# EAGLE design MJ838 - base (EAGLE 9.6.2)
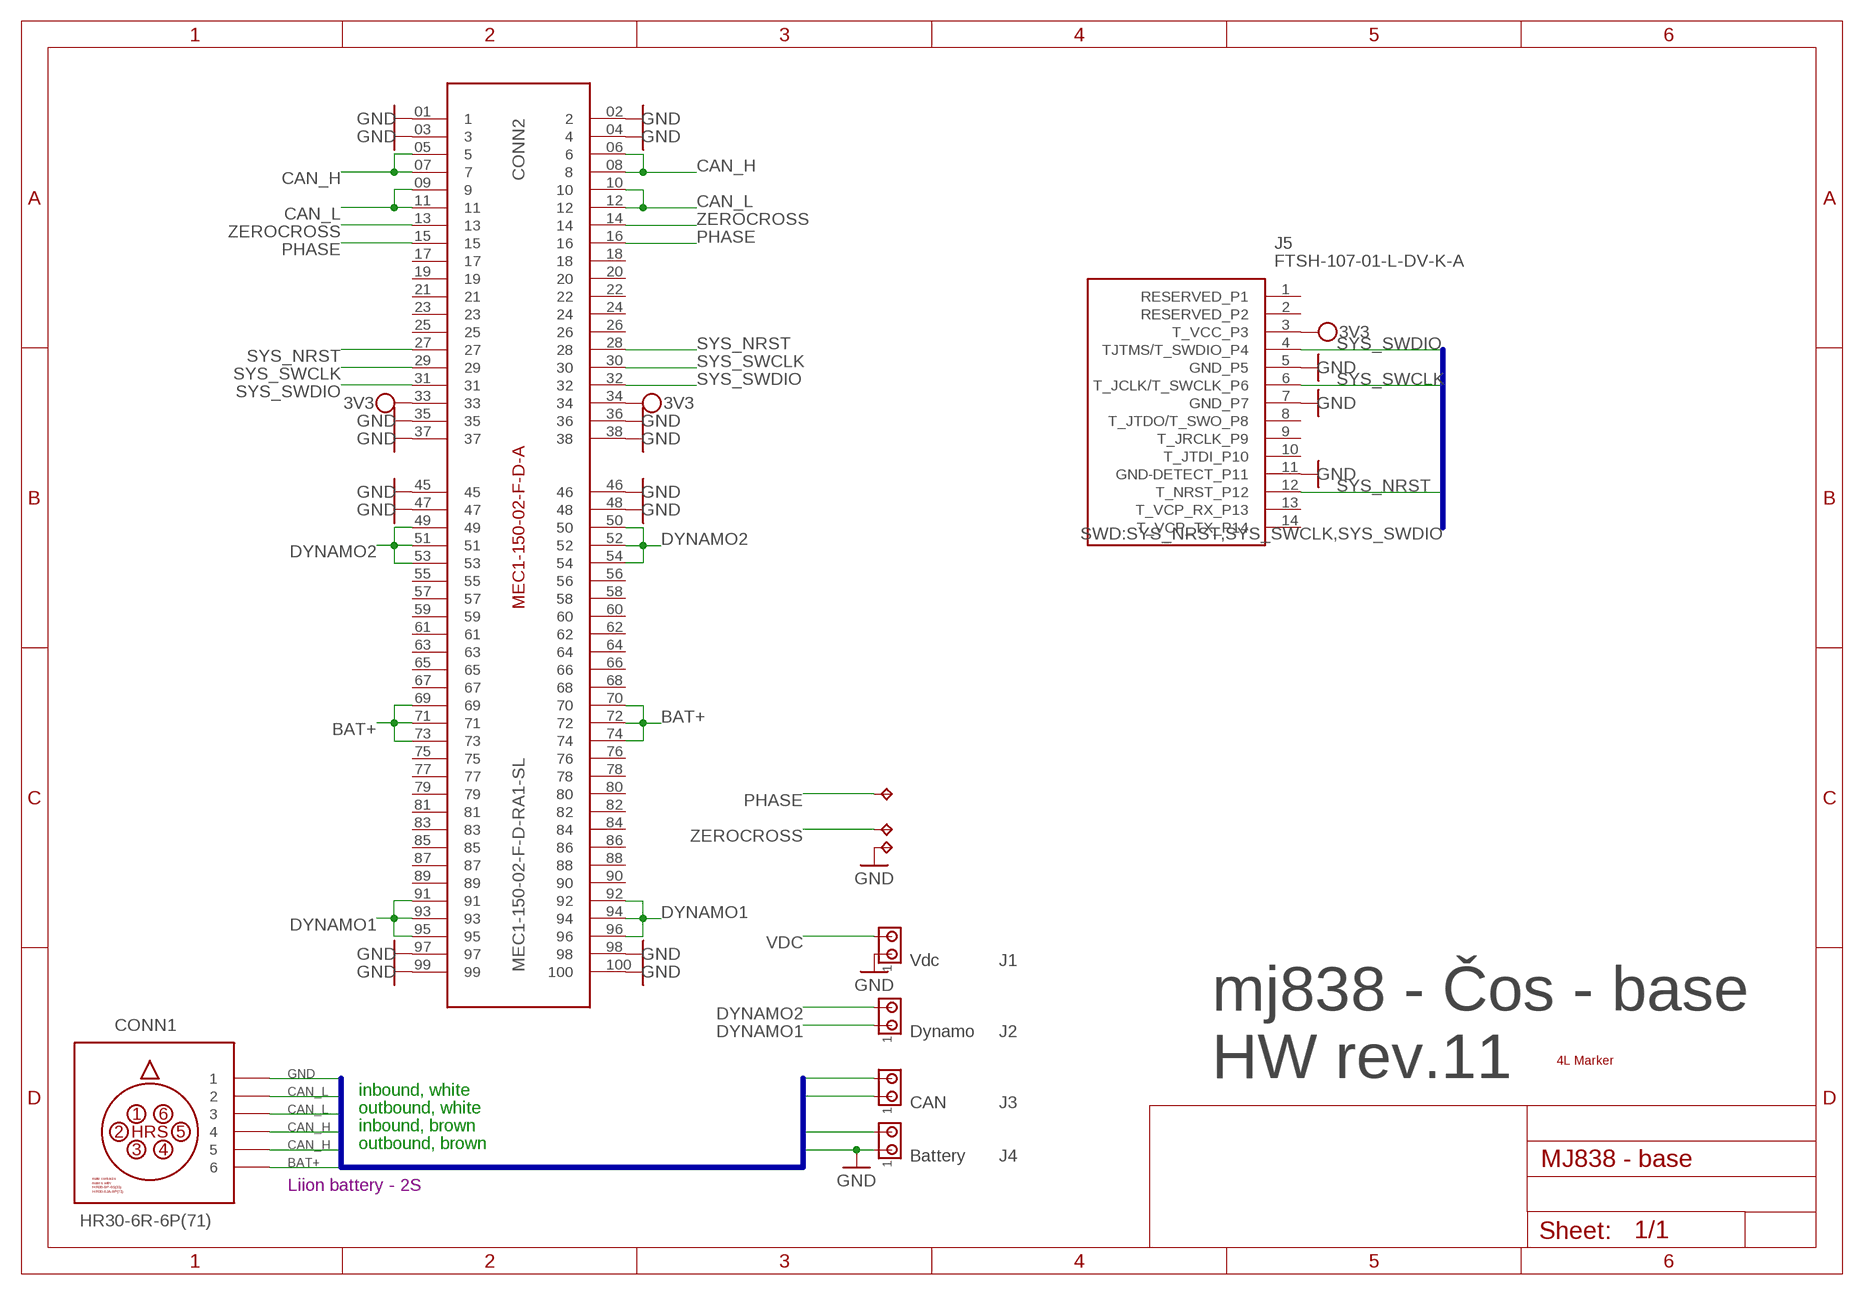
[diagram p0: schematic, sheet 1]

## Parts
CONN1  HR30-6R-6P(71)  HR-30-6R-6X  (no package)
CONN2  MEC1-150-02-F-D-RA1-SL  MEC1-150-2-F-D-RA  [SAMTEC_MEC1-150-2-F-D-RA1]
J1  Vdc  MTA02-100  [10X02MTA]
J2  Dynamo  MTA02-100  [10X02MTA]
J3  CAN  MTA02-100  [10X02MTA]
J4  Battery  MTA02-100  [10X02MTA]
J5  FTSH-107-01-L-DV-K-A  [FTSH10701LDVKA]
MARKER2  4L  [4L]
TP1  TPPAD1-13  [P1-13]
TP2  TPPAD1-13  [P1-13]
TP3  TPPAD1-13  [P1-13]

## Nets
3V3 [3V3]: CONN2.33 CONN2.34 J5.3(T_VCC_P3)
BAT+ [BAT+]: CONN1.6 CONN2.69 CONN2.70 CONN2.71 CONN2.72 CONN2.73 CONN2.74 J4.2
CAN_H [signal]: CONN1.4 CONN1.5 CONN2.05 CONN2.06 CONN2.07 CONN2.08 J3.2
CAN_L [signal]: CONN1.2 CONN1.3 CONN2.09 CONN2.10 CONN2.11 CONN2.12 J3.1
DYNAMO1 [Vac]: CONN2.91 CONN2.92 CONN2.93 CONN2.94 CONN2.95 CONN2.96 J2.1
DYNAMO2 [Vac]: CONN2.49 CONN2.50 CONN2.51 CONN2.52 CONN2.53 CONN2.54 J2.2
GND: CONN1.1 CONN2.01 CONN2.02 CONN2.03 CONN2.04 CONN2.35 CONN2.36 CONN2.37 CONN2.38 CONN2.45 CONN2.46 CONN2.47 CONN2.48 CONN2.97 CONN2.98 CONN2.99 CONN2.100 J1.1 J4.1 J5.5(GND_P5) J5.7(GND_P7) J5.11(GND-DETECT_P11) TP1.TP
PHASE: CONN2.15 CONN2.16 TP3.TP
SYS_NRST: CONN2.27 CONN2.28 J5.12(T_NRST_P12)
SYS_SWCLK [signal]: CONN2.29 CONN2.30 J5.6(T_JCLK/T_SWCLK_P6)
SYS_SWDIO [signal]: CONN2.31 CONN2.32 J5.4(TJTMS/T_SWDIO_P4)
VDC [Vdc]: J1.2
ZEROCROSS [signal]: CONN2.13 CONN2.14 TP2.TP
Unconnected: CONN2.17 CONN2.18 CONN2.19 CONN2.20 CONN2.21 CONN2.22 CONN2.23 CONN2.24 CONN2.25 CONN2.26 CONN2.55 CONN2.56 CONN2.57 CONN2.58 CONN2.59 CONN2.60 CONN2.61 CONN2.62 CONN2.63 CONN2.64 CONN2.65 CONN2.66 CONN2.67 CONN2.68 CONN2.75 CONN2.76 CONN2.77 CONN2.78 CONN2.79 CONN2.80 CONN2.81 CONN2.82 CONN2.83 CONN2.84 CONN2.85 CONN2.86 CONN2.87 CONN2.88 CONN2.89 CONN2.90 J5.1(RESERVED_P1) J5.2(RESERVED_P2) J5.8(T_JTDO/T_SWO_P8) J5.9(T_JRCLK_P9) J5.10(T_JTDI_P10) J5.13(T_VCP_RX_P13) J5.14(T_VCP_TX_P14)

## Buses
MJ8X8-BUS:BAT+,CAN_H,CAN_L,GND
SWD:SYS_NRST,SYS_SWCLK,SYS_SWDIO

## Notes on the sheet
- mj838 - Čos - base
  HW rev.11
- inbound, white
- outbound, white
- inbound, brown
- outbound, brown
- Liion battery - 2S

## Library data of the parts
CONN1 = HR30-6R-6P - PushPull Receptacle:HR-30-6R-6X
CONN2 = Samtec MEC1 - Card Edge Connector:MEC1-150-2-F-D-RA
J1-J4 = con-amp:MTA02-100: AMP connector
J5 = STM32 JTAG 1.27mm 14pin header:FTSH-107-01-L-DV-K-A: Headers & Wire Housings .050" Micro Terminal Strip Source: Datasheet <https://componentsearchengine.com/Datasheets/1/FTSH-107-01-L-DV-K-A.pdf>; DESCRIPTION: Headers & Wire Housings .050" Micro Terminal Strip; HEIGHT: 5.97mm; MANUFACTURER_NAME: SAMTEC; MANUFACTURER_PART_NUMBER: FTSH-107-01-L-DV-K-A; MOUSER_PART_NUMBER: 200-FTSH10701LDVKA; MOUSER_PRICE-STOCK: https://www.mouser.com/Search/Refine.aspx?Keyword=200-FTSH10701LDVKA
MARKER2 = Layer Markers:4L
TP1-TP3 = testpad:TP: Test pad

## Net classes
0 GND: width 0.25 mm, drill 0.35 mm, clearance 0.19 mm
1 BAT+: width 0.5 mm, drill 0.35 mm, clearance 0.5 mm to class 0, clearance 0.5 mm
2 signal: width 0.25 mm, drill 0.35 mm, clearance 0.19 mm to class 0, clearance 0.19 mm to class 1, clearance 0.19 mm
3 3V3: width 0.25 mm, drill 0.35 mm, clearance 0.19 mm to class 0, clearance 0.19 mm to class 1, clearance 0.19 mm to class 2, clearance 0.19 mm
4 Vdc: width 0.5 mm, drill 0.35 mm, clearance 0.5 mm to class 0, clearance 0.5 mm to class 1, clearance 0.5 mm to class 2, clearance 0.5 mm to class 3, clearance 0.5 mm
5 Vdynamo: width 0.5 mm, drill 0.35 mm, clearance 0.5 mm to class 0, clearance 0.5 mm to class 1, clearance 0.5 mm to class 2, clearance 0.5 mm to class 3, clearance 0.5 mm to class 4, clearance 0.5 mm
6 Vac: width 0.5 mm, drill 0.35 mm, clearance 0.5 mm to class 0, clearance 0.5 mm to class 1, clearance 0.5 mm to class 2, clearance 0.5 mm to class 3, clearance 0.5 mm to class 4, clearance 0.5 mm to class 5, clearance 0.5 mm

## Board
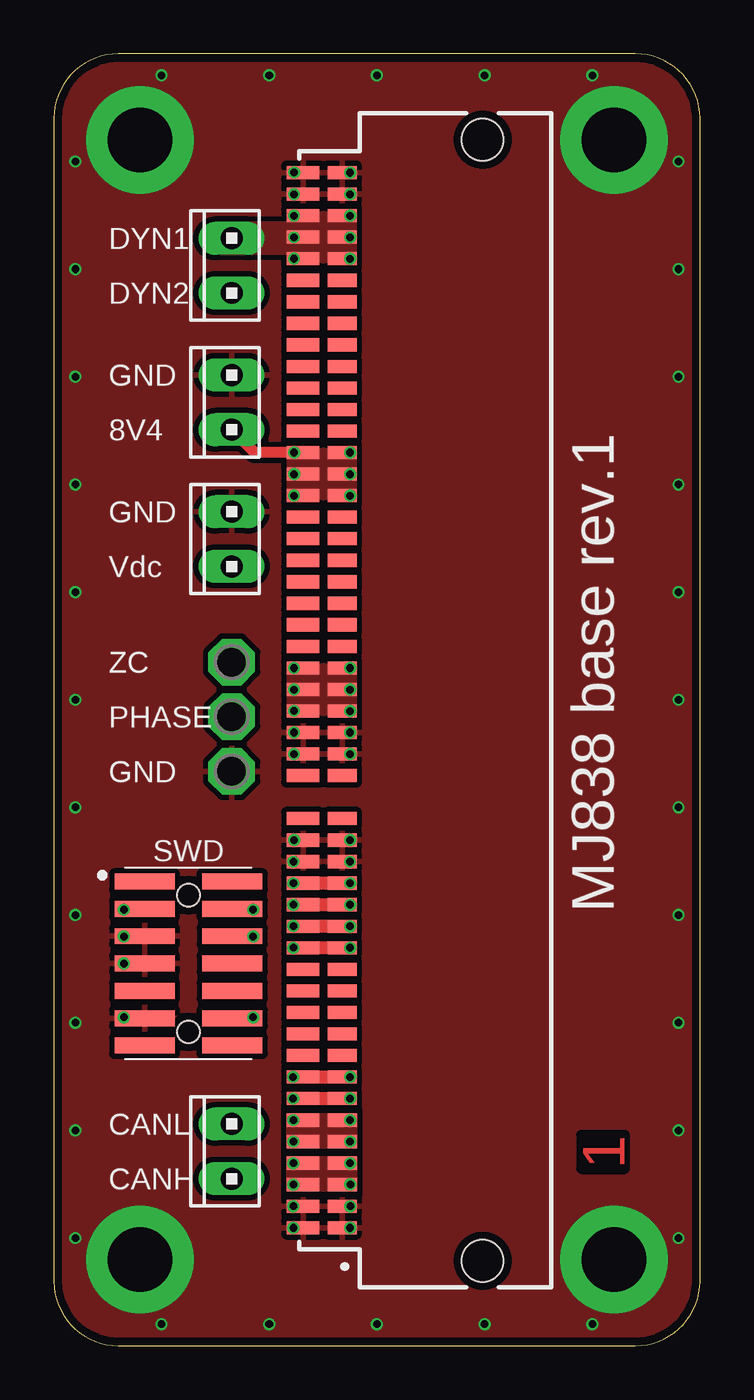
[diagram p1: board, top side]
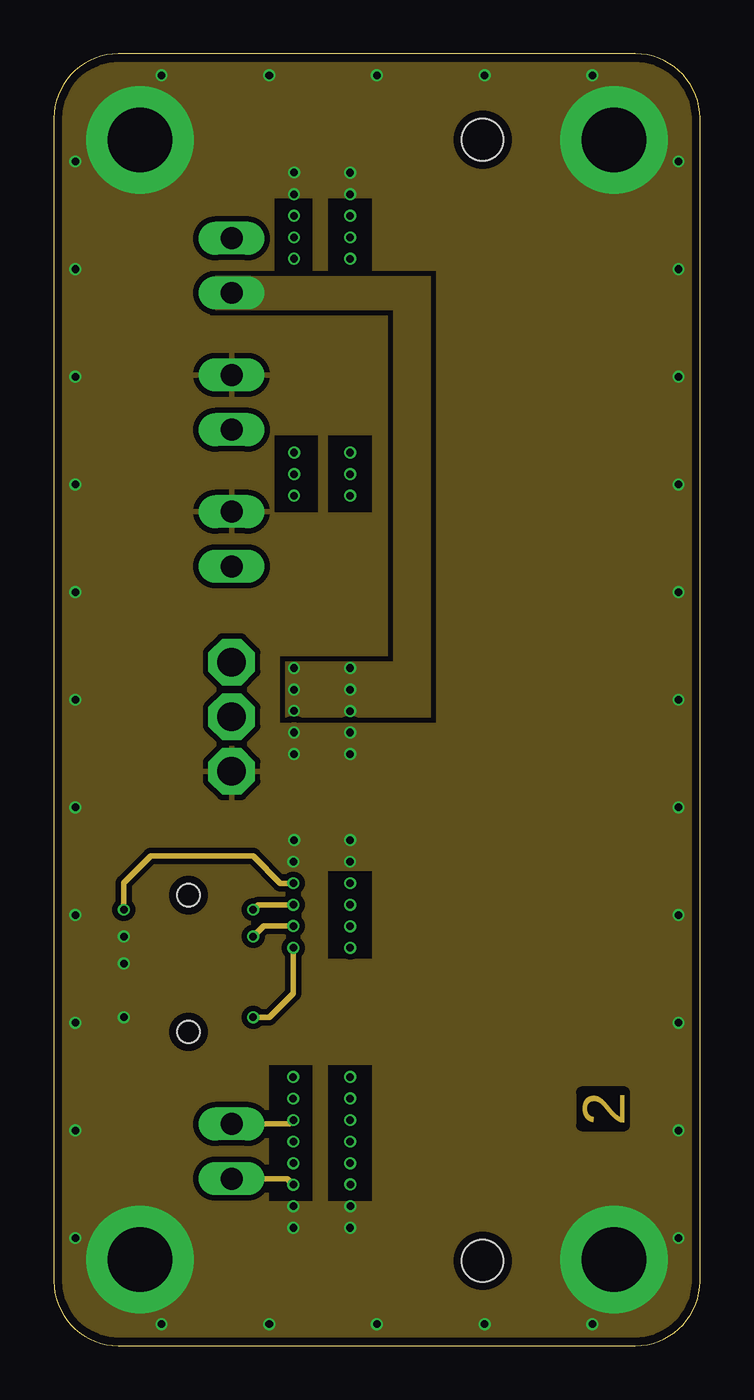
[diagram p2: board, inner layer Route2]
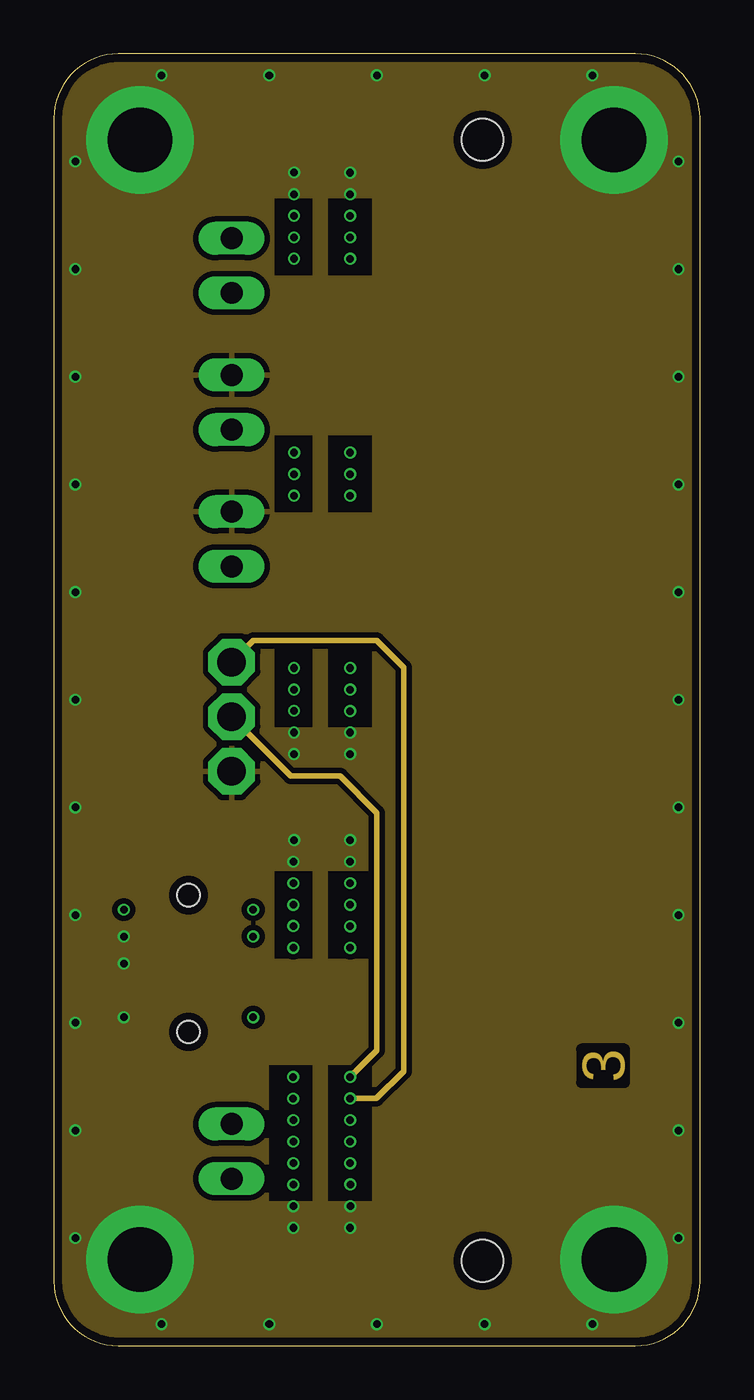
[diagram p3: board, inner layer Route15]
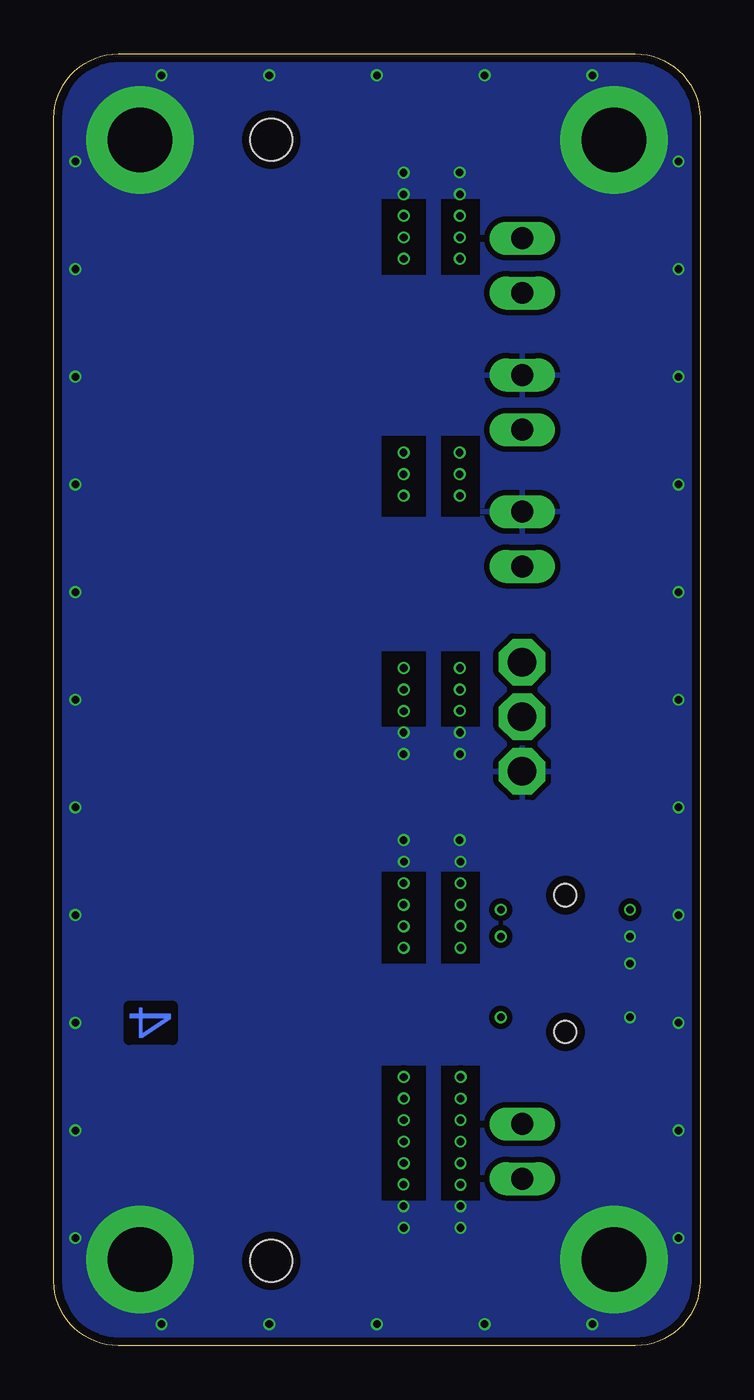
[diagram p4: board, bottom side, seen from below]

Size 30 x 60 mm. Coordinates in mm from the lower left corner, seen from the top.
Outline: 0,57 0,3 arc90 3,0 27,0 arc90 30,3 30,57 arc90 27,60 3,60 arc90 0,57
Copper layers (1*2*15*16): Top 0.035559375mm / dielectric 0.17018125mm / Route2 0.01778125mm / dielectric 47mil / Route15 0.01778125mm / dielectric 0.17018125mm / Bottom 0.035559375mm
Design rules "oshpark-4layer": minimum track width 5mil, minimum drill 10mil, track to track 5mil, track to pad 5mil, pad to pad 5mil, via to via 5mil, smd to smd 5mil, copper to edge 15mil, drill to drill 6mil, minimum pad ring 4mil, minimum via ring 4mil, stop-mask expansion 1.5mil, vias tented up to drill 0mil, thermal gap 10mil

### Footprints (pad centres in the part's own frame; a part is rotated, then mirrored left to right if it is on the bottom)
SAMTEC_MEC1-150-2-F-D-RA1 = smd 0.61 x 1.35: 01 -25.77,5.247; 03 -24.77,5.247; 05 -23.77,5.247; 07 -22.77,5.247; 09 -21.77,5.247; 11 -20.77,5.247; 13 -19.77,5.247; 15 -18.77,5.247; 17 -17.77,5.247; 19 -16.77,5.247; 21 -15.77,5.247; 23 -14.77,5.247; 25 -13.77,5.247; 27 -12.77,5.247; 29 -11.77,5.247; 31 -10.77,5.247; 33 -9.77,5.247; 35 -8.77,5.247; 37 -7.77,5.247; 39 -6.77,5.247; 43 -4.77,5.247; 45 -3.77,5.247; 47 -2.77,5.247; 49 -1.77,5.247; 51 -0.77,5.247; 53 0.23,5.247; 55 1.23,5.247; 57 2.23,5.247; 59 3.23,5.247; 61 4.23,5.247; 63 5.23,5.247; 65 6.23,5.247; 67 7.23,5.247; 69 8.23,5.247; 71 9.23,5.247; 73 10.23,5.247; 75 11.23,5.247; 77 12.23,5.247; 79 13.23,5.247; 81 14.23,5.247; 83 15.23,5.247; 85 16.23,5.247; 87 17.23,5.247; 89 18.23,5.247; 91 19.23,5.247; 93 20.23,5.247; 95 21.23,5.247; 97 22.23,5.247; 99 23.23,5.247 | smd 0.61 x 1.52: 02 -25.77,7.062; 04 -24.77,7.062; 06 -23.77,7.062; 08 -22.77,7.062; 10 -21.77,7.062; 12 -20.77,7.062; 14 -19.77,7.062; 16 -18.77,7.062; 18 -17.77,7.062; 20 -16.77,7.062; 22 -15.77,7.062; 24 -14.77,7.062; 26 -13.77,7.062; 28 -12.77,7.062; 30 -11.77,7.062; 32 -10.77,7.062; 34 -9.77,7.062; 36 -8.77,7.062; 38 -7.77,7.062; 40 -6.77,7.062; 44 -4.77,7.062; 46 -3.77,7.062; 48 -2.77,7.062; 50 -1.77,7.062; 52 -0.77,7.062; 54 0.23,7.062; 56 1.23,7.062; 58 2.23,7.062; 60 3.23,7.062; 62 4.23,7.062; 64 5.23,7.062; 66 6.23,7.062; 68 7.23,7.062; 70 8.23,7.062; 72 9.23,7.062; 74 10.23,7.062; 76 11.23,7.062; 78 12.23,7.062; 80 13.23,7.062; 82 14.23,7.062; 84 15.23,7.062; 86 16.23,7.062; 88 17.23,7.062; 90 18.23,7.062; 92 19.23,7.062; 94 20.23,7.062; 96 21.23,7.062; 98 22.23,7.062; 100 23.23,7.062 | hole 1.93: -27.305,-1.27; 24.765,-1.27
10X02MTA = drill 1.016 long: 1 1.27,0; 2 -1.27,0
FTSH10701LDVKA = smd 0.74 x 2.79: 1 -3.81,-2.035; 2 -3.81,2.035; 3 -2.54,-2.035; 4 -2.54,2.035; 5 -1.27,-2.035; 6 -1.27,2.035; 7 0,-2.035; 8 0,2.035; 9 1.27,-2.035; 10 1.27,2.035; 11 2.54,-2.035; 12 2.54,2.035; 13 3.81,-2.035; 14 3.81,2.035 | hole 1.02: -3.175,0; 3.175,0
P1-13 = drill 1.321 pad 2.159 octagon: TP 0,0

### Placement (x,y rotation side)
CONN2  18.64,31.25 90 top
J1  8.26,37.47 90 top
J2  8.26,50.16 90 top
J3  8.26,9.03 90 top
J4  8.26,43.81 90 top
J5  6.25,17.75 270 top
MARKER2  25.5,8 90 top
TP1  8.26,26.67 180 top
TP2  8.26,31.75 180 top
TP3  8.26,29.21 0 top

### Tracks (layer width: path | path; a pad name or v marks a point on that pad's centre or on a via)
3V3  (via drill 0.35)
  Top 0.25: v11.12,21.48 CONN2.34 CONN2.33 | J5.3 4.17,20.25 v3.25,20.25
  Top 0.6: v13.76,21.48 CONN2.34
  Route2 0.25: v3.25,20.25 3.25,21.5 4.5,22.75 9.25,22.75 10.52,21.48 v11.12,21.48
BAT+  (via drill 0.35)
  Top 0.5: CONN2.74 9.32,41.48 J4.2
  other vias: 13.76,41.48 13.76,40.48 13.76,39.48 11.16,41.48 11.16,40.48 11.15,39.48
  pour Top (no thermals): 10.81,41.79 10.81,39.17 14.06,39.17 14.06,41.79
CAN_H  (via drill 0.35)
  Route2 0.25: J3.2 10.84,7.75 v11.12,7.47
  other vias: 11.12,8.47 13.77,7.49 13.76,8.47
  pour Top (no thermals): 10.81,8.79 14.06,8.79 14.06,7.17 10.81,7.17
CAN_L  (via drill 0.35)
  Route2 0.25: J3.1 10.94,10.29 v11.12,10.47
  other vias: 13.76,10.47 13.76,9.48 11.12,9.48
  pour Top (no thermals): 10.81,10.79 14.06,10.79 14.06,9.18 10.81,9.18
DYNAMO1  (via drill 0.35)
  other vias: 13.76,52.48 13.76,51.48 13.76,50.48 11.15,50.49 11.15,51.48 11.15,52.48
  pour Top (no thermals): 10.81,52.79 10.81,50.17 14.06,50.17 14.06,52.79
  pour Top (no thermals): 7.75,52.2 11,52.2 11,50.67 7.75,50.67
DYNAMO2  (via drill 0.35)
  other vias: 13.76,30.48 13.76,31.48 13.76,29.48 11.15,31.48 11.15,29.49 11.15,30.48
  pour Top (no thermals): 10.81,31.79 10.81,29.18 14.06,29.18 14.06,31.79
  pour Route2 (no thermals): 17.5,49.65 7.49,49.65 7.49,48.13 15.75,48.13 15.75,31.75 10.75,31.75 10.75,29.19 17.5,29.19
EXCL
  cutout Route2: 10.25,42.25 10.25,38.75 12.25,38.75 12.25,42.25
  cutout Route2: 12.75,42.25 12.75,38.75 14.75,38.75 14.75,42.25
  cutout Route2: 12.75,22 12.75,18 14.75,18 14.75,22
  cutout Route2: 12.75,13 12.75,6.75 14.75,6.75 14.75,13
  cutout Route2: 10,13 10,6.75 12,6.75 12,13
  cutout Route2: 10.25,53.25 10.25,49.75 12,49.75 12,53.25
  cutout Route2: 12.75,53.25 12.75,49.75 14.75,49.75 14.75,53.25
  cutout Route15: 10.25,22 10.25,18 12,18 12,22
  cutout Route15: 12.75,22 12.75,18 14.75,18 14.75,22
  cutout Route15: 10,13 10,6.75 12,6.75 12,13
  cutout Route15: 12.75,13 12.75,6.75 14.75,6.75 14.75,13
  cutout Route15: 10.25,32.25 10.25,28.75 12,28.75 12,32.25
  cutout Route15: 12.75,32.25 12.75,28.75 14.75,28.75 14.75,32.25
  cutout Bottom: 12.75,13 12.75,6.75 14.75,6.75 14.75,13
  cutout Bottom: 10.25,13 10.25,6.75 12,6.75 12,13
  cutout Bottom: 12.75,22 12.75,17.75 14.75,17.75 14.75,22
  cutout Bottom: 10.25,22 10.25,17.75 12,17.75 12,22
  cutout Bottom: 10.25,32.25 10.25,28.75 12,28.75 12,32.25
  cutout Bottom: 12.75,32.25 12.75,28.75 14.75,28.75 14.75,32.25
  cutout Bottom: 12.75,42.25 12.75,38.5 14.75,38.5 14.75,42.25
  cutout Bottom: 10.25,42.25 10.25,38.5 12,38.5 12,42.25
  cutout Bottom: 10.25,53.25 10.25,49.75 12,49.75 12,53.25
  cutout Bottom: 12.75,53.25 12.75,49.75 14.75,49.75 14.75,53.25
  cutout Route15: 10.25,42.25 10.25,38.75 12,38.75 12,42.25
  cutout Route15: 12.75,42.25 12.75,38.75 14.75,38.75 14.75,42.25
  cutout Route15: 10.25,53.25 10.25,49.75 12,49.75 12,53.25
  cutout Route15: 12.75,53.25 12.75,49.75 14.75,49.75 14.75,53.25
GND  (via drill 0.35, 3 pad 5)
  other vias: 4,56 26,56 26,4 4,4 13.76,54.48 13.76,53.48 11.16,54.49 11.15,53.48 13.76,28.48 13.76,27.48 11.15,27.48 11.15,28.48 11.16,23.48 13.76,23.48 13.75,22.48 11.12,22.48 11.12,6.47 11.12,5.47 13.76,5.47 13.77,6.47 3.25,15.25 3.25,17.75 3.25,19 15,1 15,59 1,30 29,30 10,59 5,59 20,59 25,59 29,55 1,50 1,55 1,45 1,40 1,35 29,50 29,45 29,40 29,35 29,25 29,20 29,15 29,10 29,5 1,25 1,20 1,15 1,10 1,5 5,1 10,1 20,1 25,1
  pour Top (isolate 0.254, rank 6): -2,62 32,62 32,-2 -2,-2
  pour Bottom (isolate 0.254, rank 6): 32,62 -2,62 -2,-2 32,-2
  pour Route2 (isolate 0.254, rank 6): 32,62 -2,62 -2,-2 32,-2
  pour Route15 (isolate 0.254, rank 6): 32,62 -2,62 -2,-2 32,-2
PHASE  (via drill 0.35)
  Top 0.25: v13.75,12.48 v13.76,12.48 CONN2.15 | CONN2.16 v11.11,12.48
  Top 0.6: CONN2.16 v13.75,12.48
  Route15 0.25: v13.76,12.48 15,13.72 15,24.75 13.29,26.46 11.01,26.46 TP3.TP
SYS_NRST  (via drill 0.35)
  Top 0.25: CONN2.28 v11.12,18.48 | J5.12 9.21,15.21 v9.25,15.25 | CONN2.27 v13.76,18.48
  Top 0.6: v13.76,18.48 CONN2.28
  Route2 0.25: v9.25,15.25 10,15.25 11.12,16.37 v11.12,18.48
SYS_SWCLK  (via drill 0.35)
  Top 0.25: CONN2.30 v11.13,19.48 v11.12,19.49 v11.12,19.48 CONN2.29 | J5.6 9.23,19.02 v9.25,19
  Top 0.6: v13.76,19.48 CONN2.30
  Route2 0.25: v9.25,19 9.74,19.49 v11.12,19.49
SYS_SWDIO  (via drill 0.35)
  Top 0.25: CONN2.32 v11.12,20.48 CONN2.31 | J5.4 9.21,20.29 v9.25,20.25
  Top 0.6: v13.76,20.48 CONN2.32
  Route2 0.25: v9.25,20.25 9.48,20.48 v11.12,20.48
ZEROCROSS  (via drill 0.35)
  Top 0.25: CONN2.14 v11.11,11.47 | CONN2.13 v13.75,11.48
  Top 0.6: CONN2.14 CONN2.13
  Route15 0.25: v13.75,11.48 14.98,11.48 16.25,12.75 16.25,31.5 15,32.75 9.26,32.75 TP2.TP

### Text on the board
Top: GND | GND | GND | GND
Route2: GND | GND | GND | GND
Route15: GND | GND | GND | GND
Bottom: GND | GND | GND | GND
tPlace: DYN1 | DYN2 | GND | 8V4 | GND | Vdc | ZC | MJ838 base rev.1 | PHASE | GND | SWD | CANL | CANH